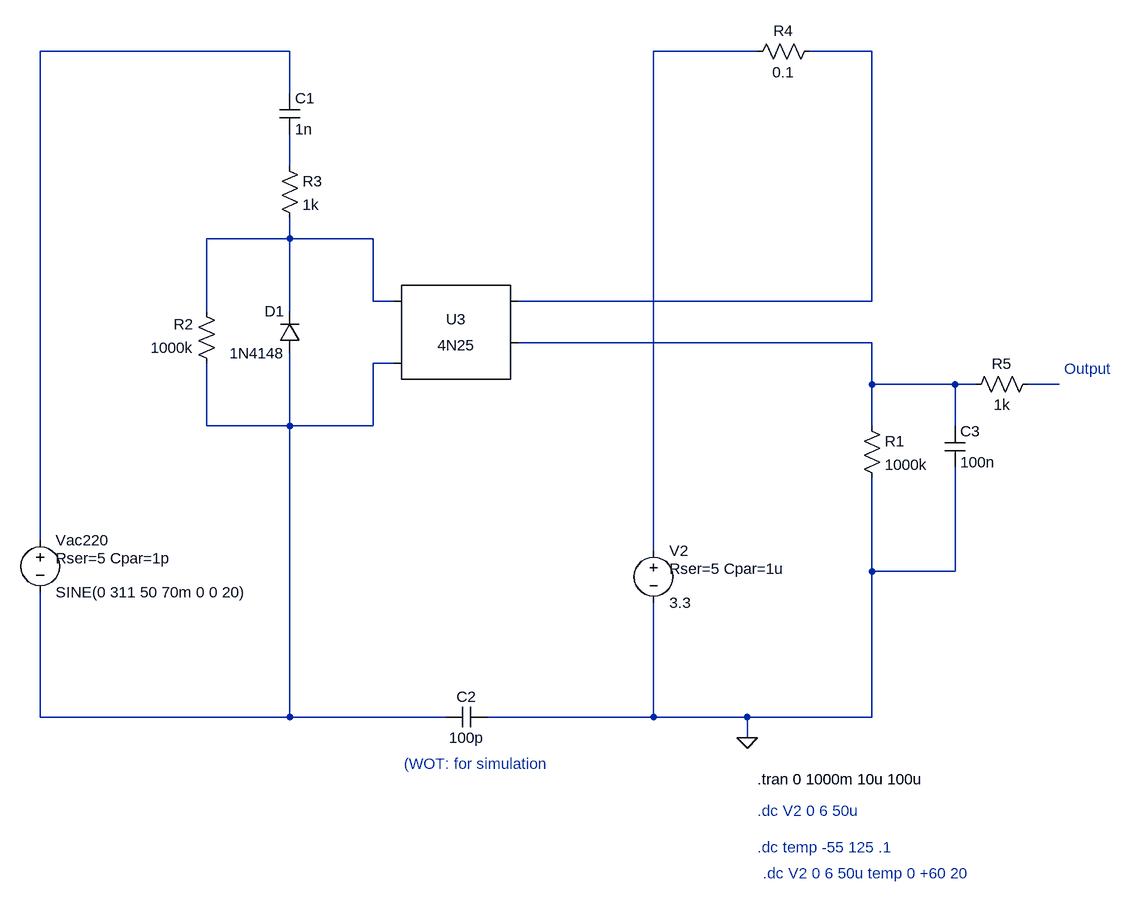
[diagram p0: schematic V2_Rex2-5.asc]
V2_Rex2-5.asc, the LTspice schematic file:
Version 4
SHEET 1 1316 704
WIRE -752 -576 -1136 -576
WIRE -32 -576 -192 -576
WIRE 144 -576 48 -576
WIRE -752 -512 -752 -576
WIRE -752 -400 -752 -448
WIRE -752 -288 -752 -320
WIRE -752 -288 -880 -288
WIRE -624 -288 -752 -288
WIRE -624 -192 -624 -288
WIRE -592 -192 -624 -192
WIRE 144 -192 144 -576
WIRE 144 -192 -400 -192
WIRE -880 -176 -880 -288
WIRE -752 -176 -752 -288
WIRE 144 -128 -400 -128
WIRE -592 -96 -624 -96
WIRE 144 -64 144 -128
WIRE 272 -64 144 -64
WIRE 304 -64 272 -64
WIRE 432 -64 384 -64
WIRE -880 0 -880 -96
WIRE -752 0 -752 -112
WIRE -752 0 -880 0
WIRE -624 0 -624 -96
WIRE -624 0 -752 0
WIRE 144 0 144 -64
WIRE 272 0 272 -64
WIRE -1136 176 -1136 -576
WIRE -192 192 -192 -576
WIRE 144 224 144 80
WIRE 272 224 272 64
WIRE 272 224 144 224
WIRE -1136 448 -1136 256
WIRE -752 448 -752 0
WIRE -752 448 -1136 448
WIRE -512 448 -752 448
WIRE -192 448 -192 272
WIRE -192 448 -448 448
WIRE -48 448 -192 448
WIRE 144 448 144 224
WIRE 144 448 -48 448
WIRE -48 480 -48 448
FLAG -48 480 0
SYMBOL res 128 -16 R0
SYMATTR InstName R1
SYMATTR Value 1000k
SYMBOL voltage -192 176 R0
WINDOW 123 0 0 Left 0
WINDOW 39 24 44 Left 2
SYMATTR SpiceLine Rser=5 Cpar=1u
SYMATTR InstName V2
SYMATTR Value 3.3
SYMBOL res 64 -592 R90
WINDOW 0 0 56 VBottom 2
WINDOW 3 32 56 VTop 2
SYMATTR InstName R4
SYMATTR Value 0.1
SYMBOL voltage -1136 160 R0
WINDOW 123 0 0 Left 0
WINDOW 39 24 44 Left 2
SYMATTR SpiceLine Rser=5 Cpar=1p
SYMATTR InstName Vac220
SYMATTR Value SINE(0 311 50 70m 0 0 20)
SYMBOL Optos\\4N25 -496 -128 R0
SYMATTR InstName U3
SYMBOL res -864 -80 R180
WINDOW 0 36 76 Left 2
WINDOW 3 36 40 Left 2
SYMATTR InstName R2
SYMATTR Value 1000k
SYMBOL cap -768 -512 R0
SYMATTR InstName C1
SYMATTR Value 1n
SYMATTR SpiceLine V=400V Rser=100
SYMBOL res -768 -416 R0
SYMATTR InstName R3
SYMATTR Value 1k
SYMBOL diode -736 -112 R180
WINDOW 0 24 64 Left 2
WINDOW 3 24 0 Left 2
SYMATTR InstName D1
SYMATTR Value 1N4148
SYMBOL cap -448 432 R90
WINDOW 0 0 32 VBottom 2
WINDOW 3 32 32 VTop 2
SYMATTR InstName C2
SYMATTR Value 100p
SYMBOL cap 256 0 R0
SYMATTR InstName C3
SYMATTR Value 100n
SYMATTR SpiceLine V=16 Rser=10 Lser=0.1u Rpar=1000k
SYMBOL res 400 -80 R90
WINDOW 0 0 56 VBottom 2
WINDOW 3 32 56 VTop 2
SYMATTR InstName R5
SYMATTR Value 1k
TEXT -32 544 Left 2 !.tran 0 1000m 10u 100u
TEXT -32 592 Left 2 ;.dc V2 0 6 50u
TEXT -32 648 Left 2 ;.dc temp -55 125 .1
TEXT -24 688 Left 2 ;.dc V2 0 6 50u temp 0 +60 20
TEXT 440 -88 Left 2 ;Output
TEXT -576 520 Left 2 ;(WOT: for simulation

The netlist it stands for:
* V2_Rex2-5.asc
R1 N006 0 1000k
V2 N002 0 3.3 Rser=5 Cpar=1u
R4 N003 N002 0.1
Vac220 N001 N007 SINE(0 311 50 70m 0 0 20) Rser=5 Cpar=1p
XU3 N005 N007 N003 N006 NC_01 4N25
R2 N007 N005 1000k
C1 N001 N004 1n V=400V Rser=100
R3 N004 N005 1k
D1 N007 N005 1N4148
C2 0 N007 100p
C3 N006 0 100n V=16 Rser=10 Lser=0.1u Rpar=1000k
R5 N008 N006 1k
.model D D
.lib standard.dio
.tran 0 1000m 10u 100u
* .dc V2 0 6 50u
* .dc temp -55 125 .1
* .dc V2 0 6 50u temp 0 +60 20
* Output
* (WOT: for simulation
.lib 4N25.sub
.backanno
.end